# Altium schematic sheet EMC.SchDoc
size A4
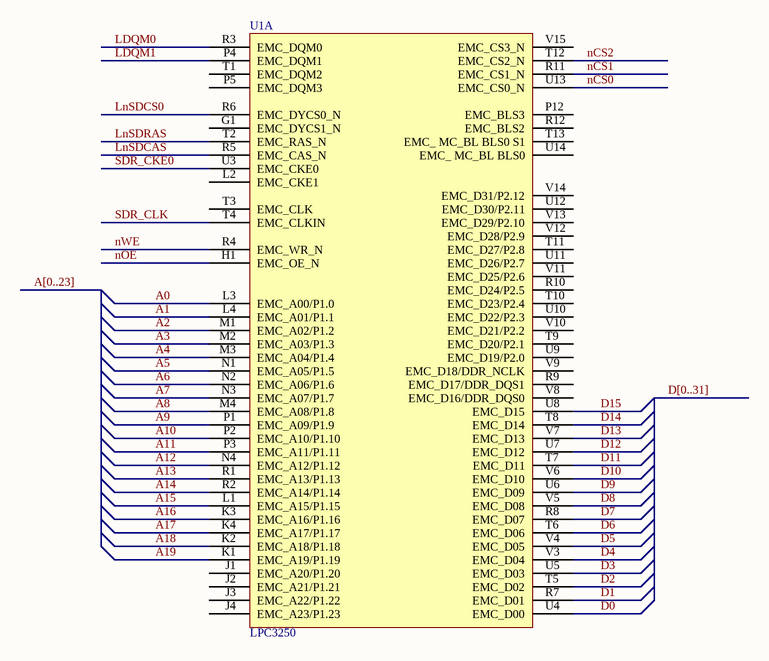
[diagram p0: EMC.SchDoc]

## Parts
U1  LPC3250  [TFBGA296]  (part A of 4)

## Nets
A0: U1.L3(EMC_A00/P1.0)
A1: U1.L4(EMC_A01/P1.1)
A2: U1.M1(EMC_A02/P1.2)
A3: U1.M2(EMC_A03/P1.3)
A4: U1.M3(EMC_A04/P1.4)
A5: U1.N1(EMC_A05/P1.5)
A6: U1.N2(EMC_A06/P1.6)
A7: U1.N3(EMC_A07/P1.7)
A8: U1.M4(EMC_A08/P1.8)
A9: U1.P1(EMC_A09/P1.9)
A10: U1.P2(EMC_A10/P1.10)
A11: U1.P3(EMC_A11/P1.11)
A12: U1.N4(EMC_A12/P1.12)
A13: U1.R1(EMC_A13/P1.13)
A14: U1.R2(EMC_A14/P1.14)
A15: U1.L1(EMC_A15/P1.15)
A16: U1.K3(EMC_A16/P1.16)
A17: U1.K4(EMC_A17/P1.17)
A18: U1.K2(EMC_A18/P1.18)
A19: U1.K1(EMC_A19/P1.19)
D0: U1.U4(EMC_D00)
D1: U1.R7(EMC_D01)
D2: U1.T5(EMC_D02)
D3: U1.U5(EMC_D03)
D4: U1.V3(EMC_D04)
D5: U1.V4(EMC_D05)
D6: U1.T6(EMC_D06)
D7: U1.R8(EMC_D07)
D8: U1.V5(EMC_D08)
D9: U1.U6(EMC_D09)
D10: U1.V6(EMC_D10)
D11: U1.T7(EMC_D11)
D12: U1.U7(EMC_D12)
D13: U1.V7(EMC_D13)
D14: U1.T8(EMC_D14)
D15: U1.U8(EMC_D15)
LDQM0: U1.R3(EMC_DQM0)
LDQM1: U1.P4(EMC_DQM1)
LnSDCAS: U1.R5(EMC_CAS_N)
LnSDCS0: U1.R6(EMC_DYCS0_N)
LnSDRAS: U1.T2(EMC_RAS_N)
nCS0: U1.U13(EMC_CS0_N)
nCS1: U1.R11(EMC_CS1_N)
nCS2: U1.T12(EMC_CS2_N)
nOE: U1.H1(EMC_OE_N)
nWE: U1.R4(EMC_WR_N)
SDR_CKE0: U1.U3(EMC_CKE0)
SDR_CLK: U1.T4(EMC_CLKIN)

Not connected (* = marked no-connect by the designer): U1 G1(EMC_DYCS1_N) J1(EMC_A20/P1.20) J2(EMC_A21/P1.21) J3(EMC_A22/P1.22) J4(EMC_A23/P1.23) L2(EMC_CKE1) P5(EMC_DQM3) P12(EMC_BLS3) R9(EMC_D17/DDR_DQS1) R10(EMC_D24/P2.5) R12(EMC_BLS2) T1(EMC_DQM2) T3(EMC_CLK) T9(EMC_D20/P2.1) T10(EMC_D23/P2.4) T11(EMC_D27/P2.8) T13(EMC__MC_BL_BLS0_S1) U9(EMC_D19/P2.0) U10(EMC_D22/P2.3) U11(EMC_D26/P2.7) U12(EMC_D30/P2.11) U14(EMC__MC_BL_BLS0) V8(EMC_D16/DDR_DQS0) V9(EMC_D18/DDR_NCLK) V10(EMC_D21/P2.2) V11(EMC_D25/P2.6) V12(EMC_D28/P2.9) V13(EMC_D29/P2.10) V14(EMC_D31/P2.12) V15(EMC_CS3_N)

## Buses and harness runs
bus A[0..23]
bus D[0..31]